# EAGLE design gatedriver_trafo_sma (EAGLE 7.2.0)
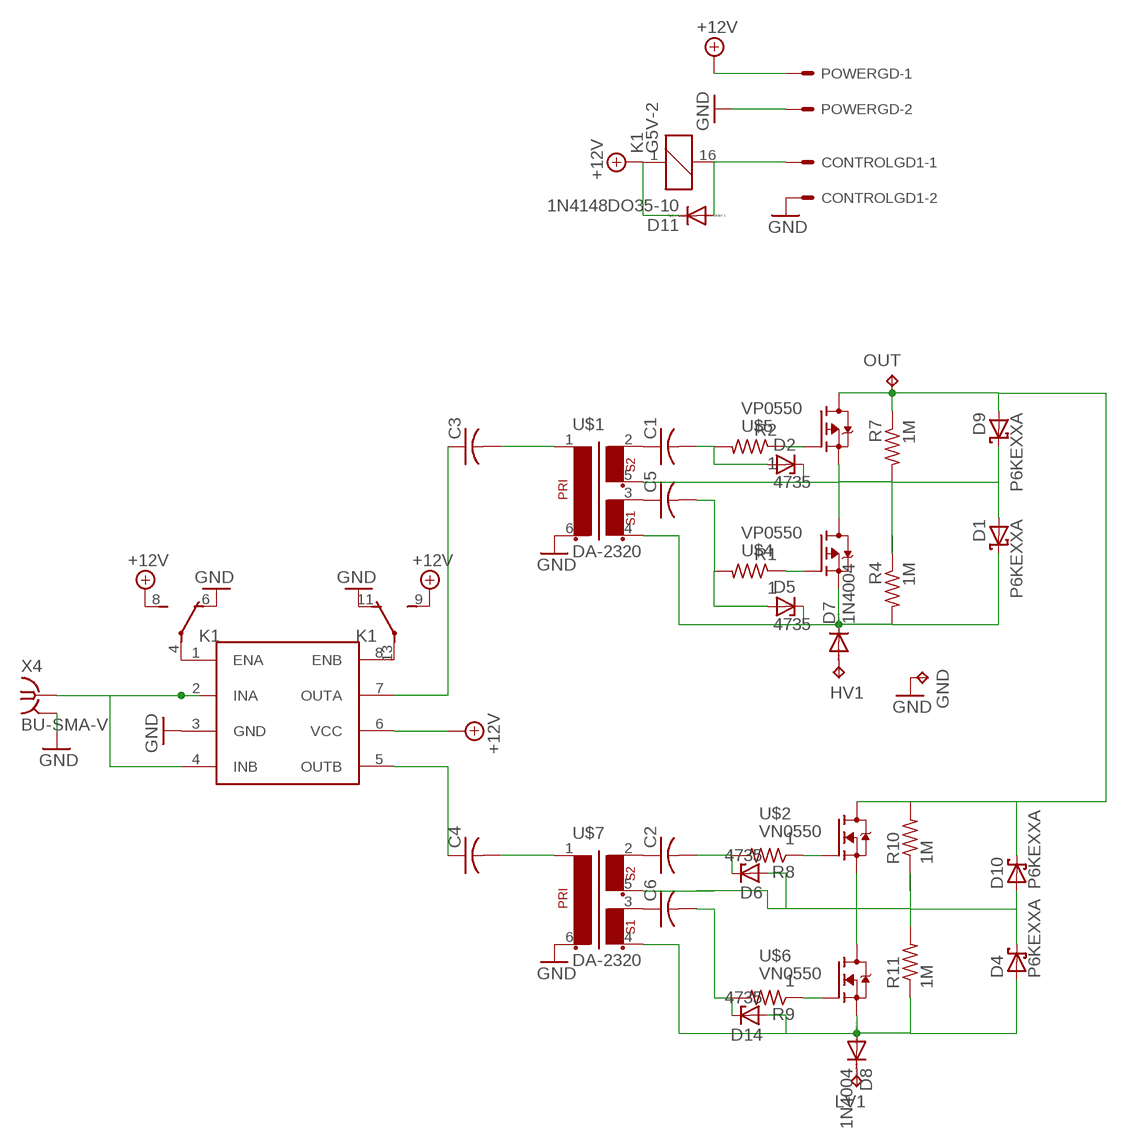
[diagram p0: schematic, sheet 1]

## Parts
C1  C-US050-055X075  [C050-055X075]
C2  C-US050-055X075  [C050-055X075]
C3  C-US050-055X075  [C050-055X075]
C4  C-US050-055X075  [C050-055X075]
C5  C-US050-055X075  [C050-055X075]
C6  C-US050-055X075  [C050-055X075]
CONTROLGD1  KK-156-2  [KK-156-2]
D1  P6KEXXA  [C1702-15]
D2  4735  ZENER-DIODEZD-10  [ZDIO-10]
D4  P6KEXXA  [C1702-15]
D5  4735  ZENER-DIODEZD-10  [ZDIO-10]
D6  4735  ZENER-DIODEZD-10  [ZDIO-10]
D7  1N4004  [DO41-10]
D8  1N4004  [DO41-10]
D9  P6KEXXA  [C1702-15]
D10  P6KEXXA  [C1702-15]
D11  1N4148DO35-10  [DO35-10]
D14  4735  ZENER-DIODEZD-10  [ZDIO-10]
GND  TPPAD1-20Y  [P1-20Y]
HV1  TPPAD1-20Y  [P1-20Y]
K1  G5V-2  [G5V-2]
LV1  TPPAD1-20Y  [P1-20Y]
OUT  TPPAD1-20Y  [P1-20Y]
POWERGD  KK-156-2  [KK-156-2]
R1  1  R-US_0207/12  [0207/12]
R2  1  R-US_0207/12  [0207/12]
R4  1M  R-US_0207/12  [0207/12]
R7  1M  R-US_0207/12  [0207/12]
R8  1  R-US_0207/12  [0207/12]
R9  1  R-US_0207/12  [0207/12]
R10  1M  R-US_0207/12  [0207/12]
R11  1M  R-US_0207/12  [0207/12]
U$1  DA-2320  [DIL06]
U$2  VN0550  [TO92-]
U$3  UCC27425  [DIL08]
U$4  VP0550  [TO92-]
U$5  VP0550  [TO92-]
U$6  VN0550  [TO92-]
U$7  DA-2320  [DIL06]
X4  BU-SMA-V  [BU-SMA-V]

## Nets
+15V: D11.C K1.1 K1.8(1:S) K1.9(2:S) POWERGD.1 U$3.6(VCC) ; supply symbol labelled +12V
ENSW: CONTROLGD1.1 D11.A K1.16
GND: CONTROLGD1.2 GND.TP K1.6(1:O) K1.11(2:O) POWERGD.2 U$1.6 U$3.3(GND) U$7.6 X4.2 X4.3 X4.4 X4.5
N$1: U$3.2(INA) U$3.4(INB) X4.1
N$2: C3.1 U$3.7(OUTA)
N$3: C3.2 U$1.1
N$4: C4.1 U$3.5(OUTB)
N$5: C1.1 U$1.2
N$6: C4.2 U$7.1
N$7: C5.1 U$1.3
N$8: D9.A D10.C OUT.TP R7.1 R10.2 U$2.1(D) U$5.1(D)
N$9: U$7.5
N$10: D8.C LV1.TP
N$11: R2.1 U$5.2(G)
N$14: K1.4(1:P) U$3.1(ENA)
N$15: K1.13(2:P) U$3.8(ENB)
N$16: R1.1 U$4.2(G)
N$17: D1.C D5.C D7.C R4.2 U$1.4 U$4.3(S)
N$18: C1.2 D2.A R2.2
N$19: C5.2 D5.A R1.2
N$20: D4.C D6.A D10.A R10.1 R11.2 U$2.3(S) U$6.1(D)
N$21: D1.A D2.C D9.C R4.1 R7.2 U$1.5 U$4.1(D) U$5.3(S)
N$22: C2.1 U$7.2
N$23: C6.1 U$7.3
N$24: R8.1 U$2.2(G)
N$25: C2.2 D6.C R8.2
N$26: C6.2 D14.C R9.2
N$27: R9.1 U$6.2(G)
N$29: D7.A HV1.TP
N$30: D4.A D8.A D14.A R11.1 U$6.3(S) U$7.4

## Library data of the parts
C1-C6 = resistor:C-US: CAPACITOR, American symbol
CONTROLGD1 POWERGD = con-molex:KK-156-2: KK 156 HEADER Source: http://www.molex.com/pdm_docs/sd/026604100_sd.pdf; OC_FARNELL: unknown; OC_NEWARK: unknown
D1 D4 D9 D10 = diode:P6KEXXA: DIODE transient-voltage suppressor
D2 D5 D6 D14 = diode:ZENER-DIODE: Z-Diode
D7 D8 = diode:1N4004: DIODE general purpose rectifier, 1 A
D11 = diode:1N4148: DIODE high speed (Philips)
GND HV1 LV1 OUT = testpad:TP: Test pad
K1 = relay:G5V-2: OMRON PCB Relay Source: http://www.omron.com/ecb/products/pdf/en-g5v2.pdf; MPN: G5V-2 5DC; OC_FARNELL: 9949488; OC_NEWARK: 78K5703
R1 R2 R4 R7-R11 = rcl:R-US_: RESISTOR, American symbol
U$1 U$7 = trafo:DA-2320
U$2 U$6 = transistor-fet:VN0550
U$3 = texas:UCC27425
U$4 U$5 = transistor-fet:VP0550
X4 = con-coax:BU-SMA-V: FEMALE SMA CONNECTOR Radiall distributor RS 112-3794; OC_FARNELL: unknown; OC_NEWARK: unknown

## Board
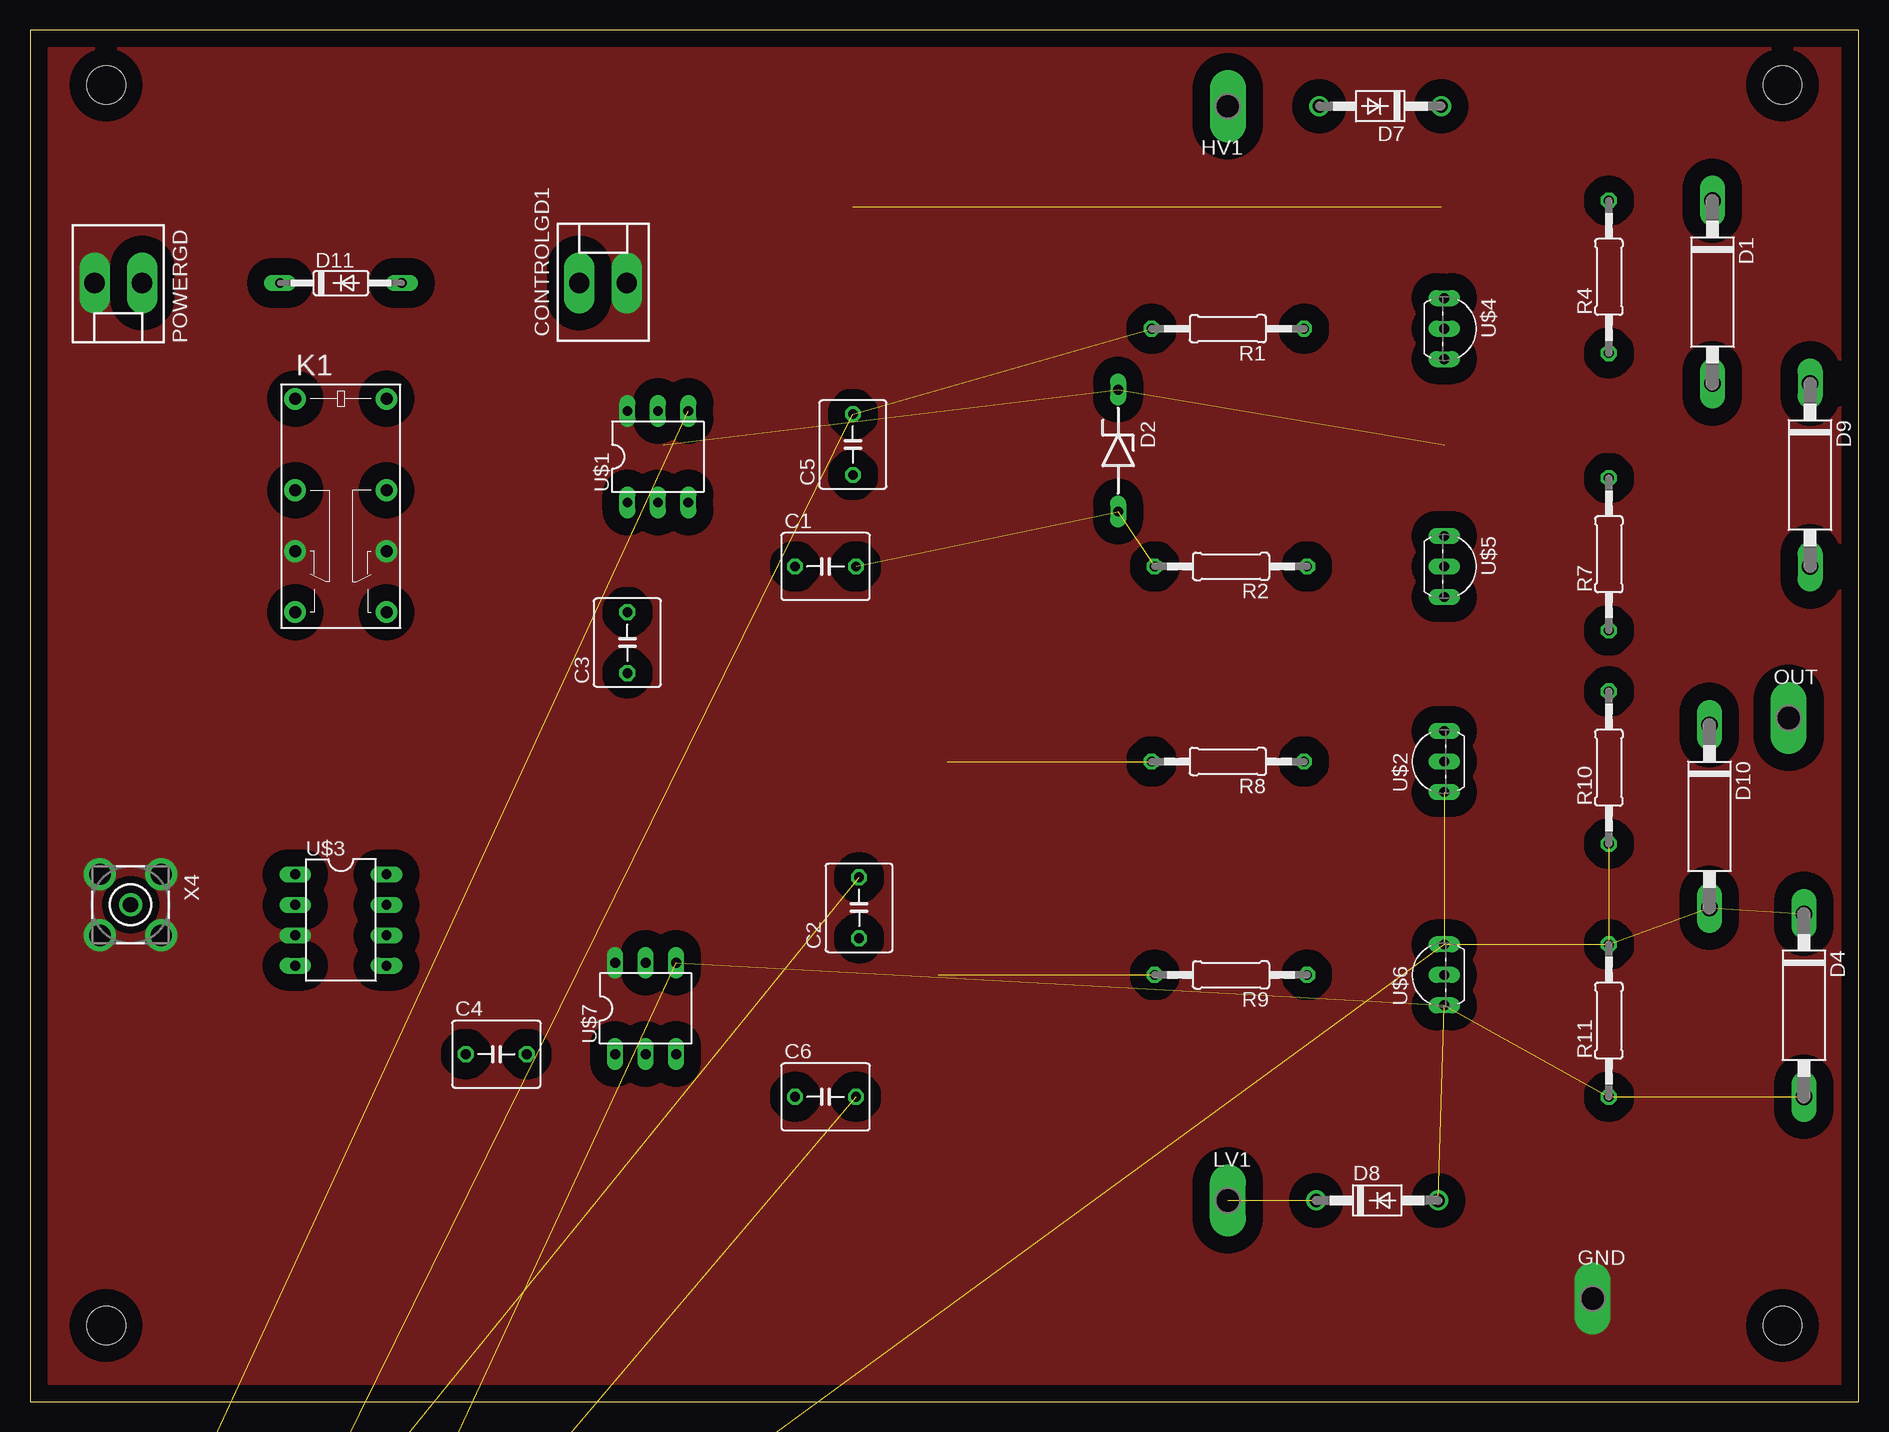
[diagram p1: board, top side]
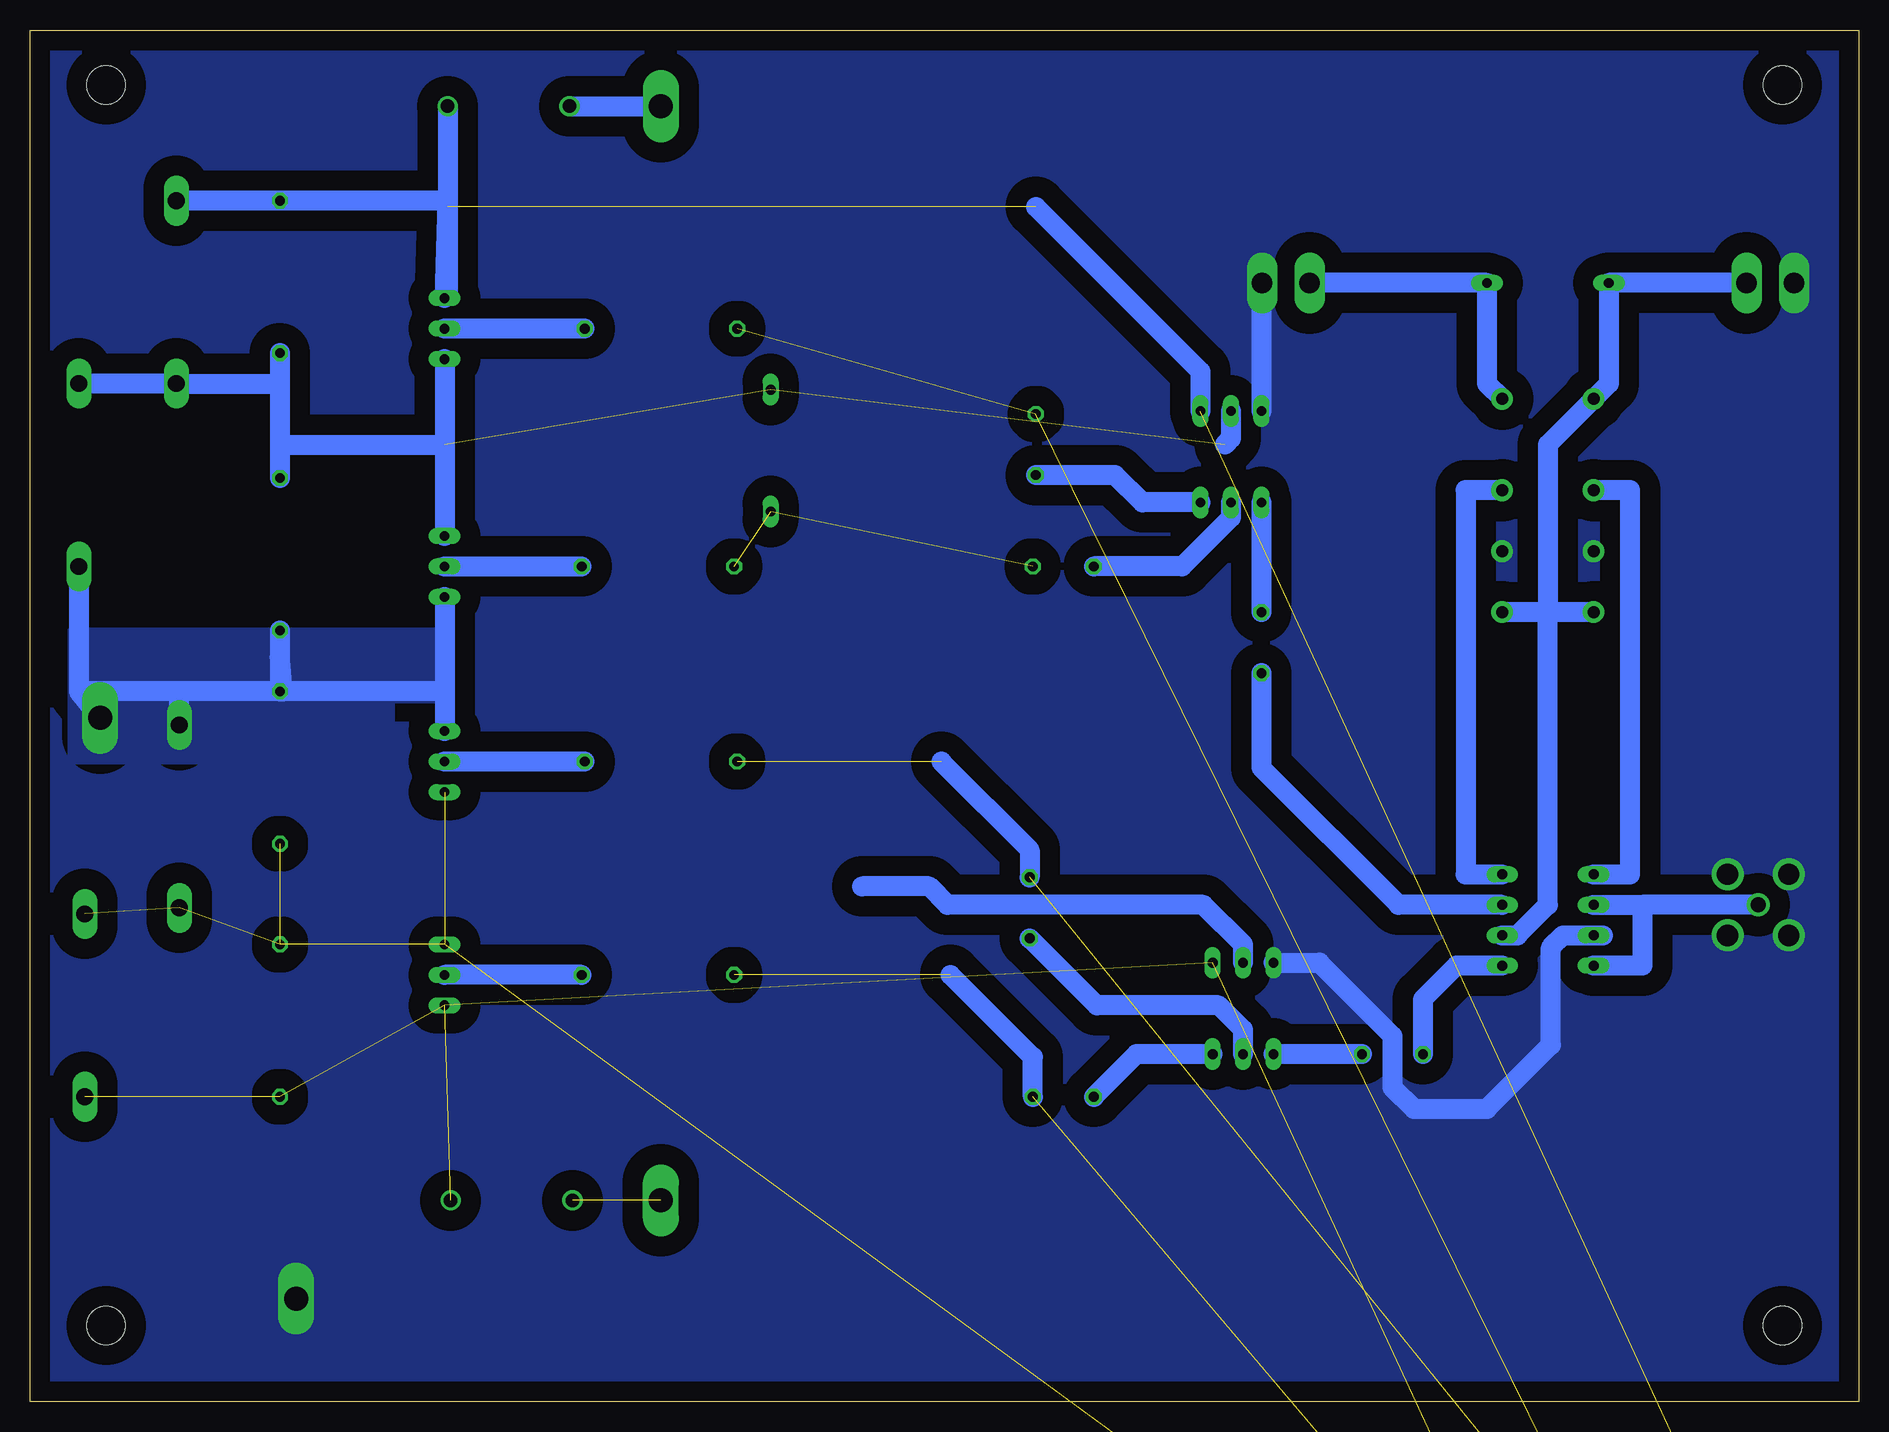
[diagram p2: board, bottom side, seen from below]

Size 152.4 x 114.3 mm. Coordinates in mm from the lower left corner, seen from the top.
Outline: 0,0 152.4,0 152.4,114.3 0,114.3 0,0
Copper layers (1*16): Top 0.035mm / dielectric 1.5mm / Bottom 0.035mm
Design rules "default": minimum track width 10mil, minimum drill 24mil, track to track 8mil, track to pad 8mil, pad to pad 8mil, via to via 8mil, smd to smd 8mil, copper to edge 40mil, drill to drill 8mil, minimum pad ring 10mil, minimum via ring 8mil, stop-mask expansion 4mil, vias tented up to drill 0mil, thermal gap 10mil
Holes 3.2 mm at 146.05,109.73 146.05,6.35 6.35,6.35 6.35,109.73

### Footprints (pad centres in the part's own frame; a part is rotated, then mirrored left to right if it is on the bottom)
C050-055X075 = drill 0.813 octagon: 1 -2.54,0; 2 2.54,0
KK-156-2 = drill 1.7 pad 2.184 long: 1 -1.98,0; 2 1.98,0
C1702-15 = drill 1.397 long: A 7.62,0; C -7.62,0
ZDIO-10 = drill 0.813 long: A 5.08,0; C -5.08,0
DO41-10 = drill 1.118: A 5.08,0; C -5.08,0
DO35-10 = drill 0.813 long: A 5.08,0; C -5.08,0
P1-20Y = drill 2.007 pad 2.54 long: TP 0,0
G5V-2 = drill 1 pad 1.8: 1 -8.89,-3.81; 4 -1.27,-3.81; 6 3.81,-3.81; 8 8.89,-3.81; 9 8.89,3.81; 11 3.81,3.81; 13 -1.27,3.81; 16 -8.89,3.81
0207/12 = drill 0.813 octagon: 1 -6.35,0; 2 6.35,0
DIL06 = drill 0.813 long: 1 -2.54,-3.81; 2 0,-3.81; 3 2.54,-3.81; 4 2.54,3.81; 5 0,3.81; 6 -2.54,3.81
TO92- = drill 0.813 long: 1 2.54,0; 2 0,0; 3 -2.54,0
DIL08 = drill 0.813 long: 1 -3.81,-3.81; 2 -1.27,-3.81; 3 1.27,-3.81; 4 3.81,-3.81; 5 3.81,3.81; 6 1.27,3.81; 7 -1.27,3.81; 8 -3.81,3.81
BU-SMA-V = drill 1.27: 1 0,0 | drill 1.778: 2 -2.55,2.55; 3 2.55,2.55; 4 2.55,-2.55; 5 -2.55,-2.55

### Placement (x,y rotation side)
C1  66.29,69.6 0 top
C2  69.09,41.15 90 top
C3  49.78,63.25 90 top
C4  38.86,28.96 0 top
C5  68.58,79.76 90 top
C6  66.29,25.4 0 top
CONTROLGD1  47.75,93.22 0 top
D1  140.21,92.46 270 top
D2  90.68,79.25 270 top
D4  147.83,33.02 270 top
D5  7.11,-32 0 top  (outside the outline)
D6  7.11,-39.12 0 top  (outside the outline)
D7  112.52,107.95 180 top
D8  112.27,16.76 0 top
D9  148.34,77.22 270 top
D10  139.95,48.77 270 top
D11  25.91,93.22 0 top
D14  7.11,-53.34 0 top  (outside the outline)
GND  130.23,8.59 0 top
HV1  99.82,107.95 180 top
K1  25.91,74.68 270 top
LV1  99.82,16.76 0 top
OUT  146.56,56.97 0 top
POWERGD  7.37,93.22 180 top
R1  99.82,89.41 180 top
R2  100.08,69.6 180 top
R4  131.57,93.73 90 top
R7  131.57,70.61 90 top
R8  99.82,53.34 180 top
R9  100.08,35.56 180 top
R10  131.57,52.83 90 top
R11  131.57,31.75 90 top
U$1  52.32,78.74 0 top
U$2  117.86,53.34 90 top
U$3  25.91,40.13 270 top
U$4  117.86,89.41 270 top
U$5  117.86,69.6 270 top
U$6  117.86,35.56 90 top
U$7  51.31,32.77 0 top
X4  8.38,41.4 270 top

### Tracks (layer width: path | path; a pad name or v marks a point on that pad's centre or on a via)
+15V
  Bottom 1.676: POWERGD.1 D11.C 20.83,84.84 K1.1 25.91,79.76 25.91,65.79 | 25.91,65.79 25.91,41.4 28.45,38.86 U$3.6 | 25.91,65.79 K1.9 | K1.8 25.91,65.79
ENSW
  Bottom 1.676: CONTROLGD1.1 D11.A 30.99,84.84 K1.16
GND
  Bottom 1.676: CONTROLGD1.2 49.78,93.22 U$1.6 | U$7.6 44.96,36.58 38.86,30.48 38.86,26.16 37.08,24.38 30.99,24.38 25.65,29.72 25.65,37.85 24.64,38.86 21.34,38.86
  pour Bottom (isolate 1.676, no thermals): 0,114.3 152.15,114.3 152.15,-0.25 0,-0.25
  pour Top (isolate 1.422, rank 6, no thermals): 0,114.3 152.65,114.3 152.65,-0.25 0,-0.25
N$1
  Bottom 1.676: X4.1 18.03,41.4 | U$3.2 18.03,41.4 | 18.03,41.4 18.03,36.32 U$3.4
N$2
  Bottom 1.676: U$3.7 38.35,41.4 49.78,52.83 C3.1
N$3
  Bottom 1.676: U$1.1 C3.2
N$4
  Bottom 1.676: U$3.5 33.53,36.32 36.32,33.53 C4.1
N$5
  Bottom 1.676: U$1.2 52.32,73.66 56.39,69.6 C1.1
N$6
  Bottom 1.676: C4.2 U$7.1
N$7
  Bottom 1.676: U$1.3 59.69,74.93 61.98,77.22 C5.1
N$8
  Bottom 1.676: 117.86,59.18 U$2.1 | R7.1 131.57,62.23 | 131.57,62.23 R10.2 140.21,59.18 | D9.A 148.34,59.18 | 148.34,59.18 OUT.TP | U$5.1 117.86,59.18 | 117.86,59.18 131.32,59.18 131.57,62.23 | 140.21,59.18 148.34,59.18 | D10.C 139.95,58.93 140.21,59.18
  pour Bottom (isolate 1.676, no thermals): 117.35,64.26 149.1,64.26 149.1,53.34 122.17,53.34 122.17,58.42 117.35,58.42
N$9
  Bottom 1.676: U$7.5 51.31,38.1 54.61,41.4 75.95,41.4 77.47,42.93 83.06,42.93
N$10  (1 unrouted)
N$11
  Bottom 1.676: U$5.2 R2.1
N$14
  Bottom 1.676: 21.59,43.94 U$3.1 19.05,43.94 19.05,75.95 K1.4
N$15
  Bottom 1.676: K1.13 32.77,75.95 32.77,43.94 U$3.8
N$16
  Bottom 1.676: R1.1 U$4.2
N$17  (2 unrouted)
  Bottom 1.676: 68.58,99.57 54.86,85.85 U$1.4 | D7.C 117.6,100.08 | 117.6,100.08 117.6,99.57 117.6,92.2 U$4.3 117.6,100.08 | 117.6,100.08 R4.2 D1.C
N$18  (2 unrouted)
N$19  (2 unrouted)
N$20  (6 unrouted)
N$21  (2 unrouted)
  Bottom 1.676: U$1.5 52.32,80.26 52.83,79.76 | 131.57,79.76 R7.2 | U$4.1 117.86,79.76 | 117.86,79.76 U$5.3 | R4.1 131.57,84.84 | 131.57,79.76 117.86,79.76 | D9.C D1.A 131.57,84.84 | 131.57,84.84 131.57,79.76
N$22
  Bottom 1.676: U$7.2 51.31,30.99 53.34,33.02 63.5,33.02 C2.1
N$23
  Bottom 1.676: U$7.3 60.2,28.96 C6.1
N$24
  Bottom 1.676: R8.1 U$2.2
N$25  (2 unrouted)
  Bottom 1.676: 76.45,53.34 69.09,45.97 C2.2
N$26  (2 unrouted)
  Bottom 1.676: C6.2 68.83,28.7 75.69,35.56
N$27
  Bottom 1.676: R9.1 U$6.2
N$29
  Bottom 1.676: D7.A HV1.TP
N$30  (5 unrouted)